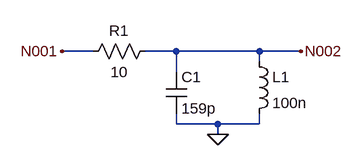
[diagram p0: schematic Pasa_bandas.asc]
Pasa_bandas.asc, the LTspice schematic file:
Version 4
SHEET 1 880 680
WIRE 144 128 96 128
WIRE 272 128 224 128
WIRE 400 128 272 128
WIRE 464 128 400 128
WIRE 400 144 400 128
WIRE 272 160 272 128
WIRE 272 240 272 224
WIRE 336 240 272 240
WIRE 400 240 400 224
WIRE 400 240 336 240
WIRE 336 256 336 240
FLAG 336 256 0
FLAG 96 128 N001
FLAG 464 128 N002
SYMBOL res 240 112 R90
WINDOW 0 0 56 VBottom 2
WINDOW 3 32 56 VTop 2
SYMATTR InstName R1
SYMATTR Value 10
SYMBOL cap 256 160 R0
SYMATTR InstName C1
SYMATTR Value 159p
SYMBOL ind 384 128 R0
SYMATTR InstName L1
SYMATTR Value 100n

The netlist it stands for:
* Pasa_bandas.asc
R1 N002 N001 10
C1 N002 0 159p
L1 N002 0 100n
.backanno
.end